# Altium schematic sheet Main.SchDoc
size A4
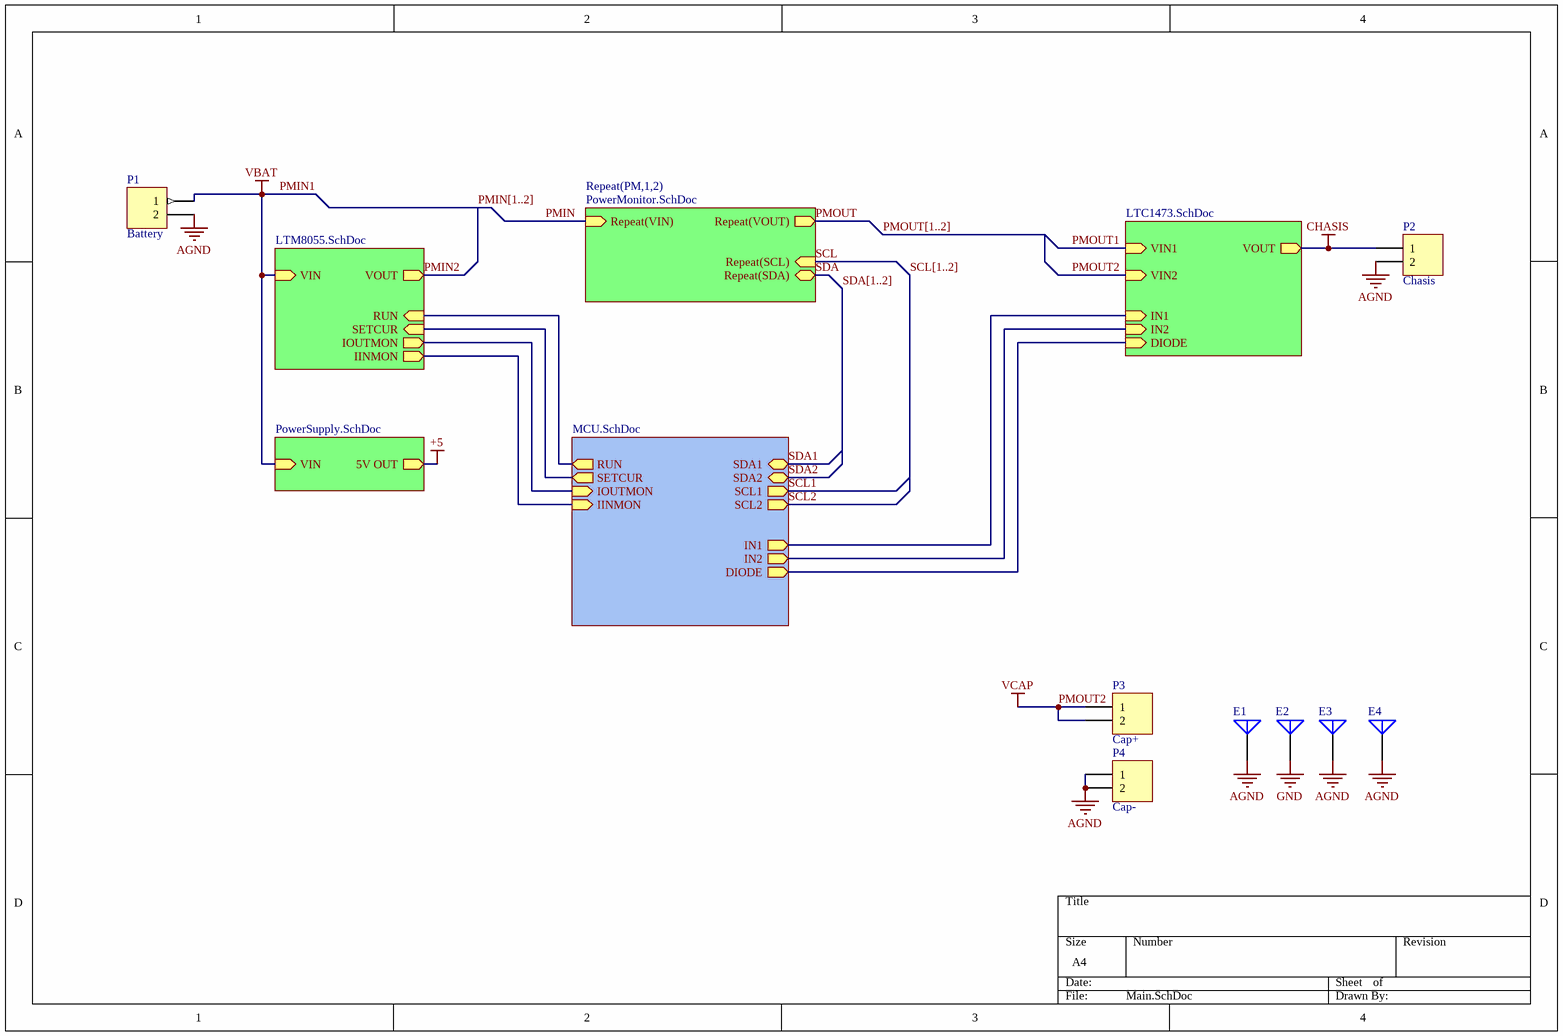
[diagram p0: Main.SchDoc]

## Parts
E1  螺丝孔  [M3x4_N]  (value not drawn)
E2  螺丝孔  [M3x4_N]  (value not drawn)
E3  螺丝孔  [M3x4_N]  (value not drawn)
E4  螺丝孔  [M3x4_N]  (value not drawn)
P1  Battery  [TX60PW-M20]
P2  Chasis  [TX60PW-F20]
P3  Cap+  [XT30PW-F]
P4  Cap-  [XT30U-M]

## Sub-sheets
LTC1473 = LTC1473.SchDoc: VIN1 (in), VOUT (out), VIN2 (in), IN2 (in), DIODE (in), IN1 (in)
LTM8055 = LTM8055.SchDoc: VIN (in), VOUT (out), IOUTMON (out), IINMON (out), RUN (in), SETCUR (in)
MCU = MCU.SchDoc: RUN (out), SETCUR (out), IOUTMON (in), IINMON (in), SDA1 (bidir), SDA2 (bidir), SCL1 (out), SCL2 (out), IN1 (out), IN2 (out), DIODE (out)
PowerSupply = PowerSupply.SchDoc: VIN (in), 5V OUT (out)
Repeat(PM,1,2) = PowerMonitor.SchDoc: Repeat(VIN) (in), Repeat(VOUT) (out), Repeat(SCL) (in), Repeat(SDA) (bidir)

## Nets
+5: sheet PowerSupply/5V OUT
AGND: E1.1(A) E3.1(A) E4.1(A) P1.2 P2.2 P4.1 P4.2
CHASIS: P2.1 ; sheet LTC1473/VOUT
GND: E2.1(A)
PMIN1: P1.1 ; sheet LTM8055/VIN, sheet PowerSupply/VIN  [also labelled VBAT]
PMOUT2: P3.1 P3.2 ; sheet LTC1473/VIN2  [also labelled VCAP]
PMIN: sheet Repeat(PM,1,2)/Repeat(VIN)
PMIN2: sheet LTM8055/VOUT
PMOUT: sheet Repeat(PM,1,2)/Repeat(VOUT)
PMOUT1: sheet LTC1473/VIN1
SCL: sheet Repeat(PM,1,2)/Repeat(SCL)
SCL1: sheet MCU/SCL1
SCL2: sheet MCU/SCL2
SDA: sheet Repeat(PM,1,2)/Repeat(SDA)
SDA1: sheet MCU/SDA1
SDA2: sheet MCU/SDA2
(unnamed): sheet LTM8055/IOUTMON, sheet MCU/IOUTMON
(unnamed): sheet LTM8055/IINMON, sheet MCU/IINMON
(unnamed): sheet LTM8055/RUN, sheet MCU/RUN
(unnamed): sheet LTM8055/SETCUR, sheet MCU/SETCUR
(unnamed): sheet MCU/IN1, sheet LTC1473/IN1
(unnamed): sheet MCU/IN2, sheet LTC1473/IN2
(unnamed): sheet MCU/DIODE, sheet LTC1473/DIODE

## Buses and harness runs
bus PMIN[1..2]
bus PMOUT[1..2]
bus SCL[1..2]
bus SDA[1..2]

## Library data of the parts
E1-E4 = Antenna: M3螺丝孔; Published: 24-Mar-1999; LatestRevisionDate: 17-Jul-2002; LatestRevisionNote: Re-released for DXP Platform.; PackageReference: PIN1; Publisher: Altium Limited
P1-P4 = Header 2: XT电源接口; LatestRevisionDate: 17-Jul-2002; LatestRevisionNote: Re-released for DXP Platform.; Publisher: Altium Limited